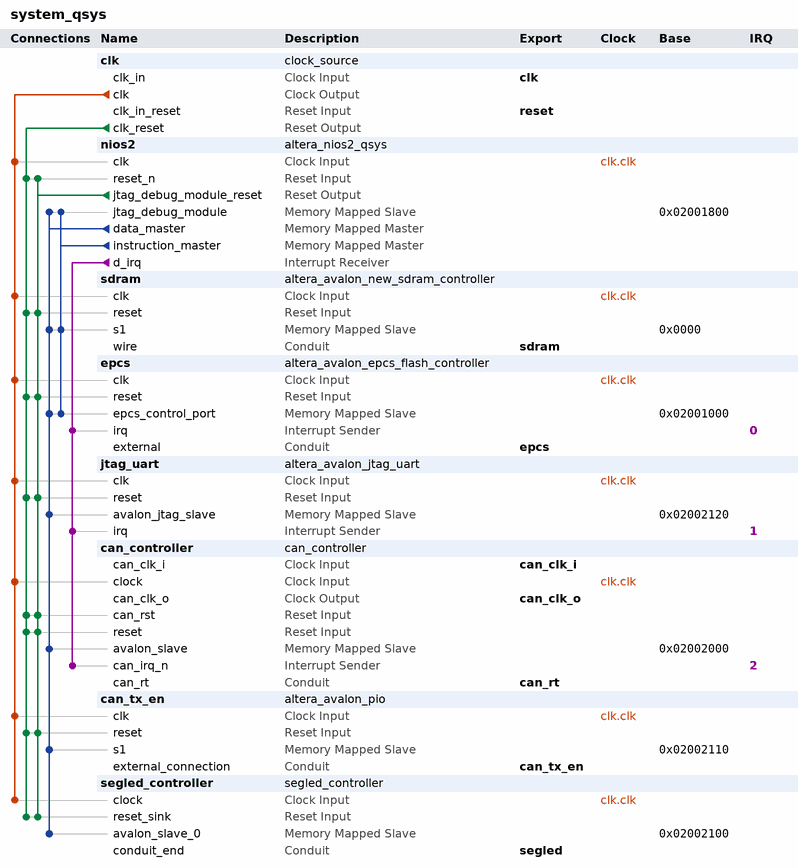
[diagram p0: system contents]
# Platform Designer (Qsys) system system_qsys, Cyclone IV E EP4CE10F17C8
# Parameters at their usual value, and those the tool derives, are not listed.
package require -exact qsys 13.1
create_system system_qsys
set_project_property DEVICE_FAMILY {Cyclone IV E}
set_project_property DEVICE EP4CE10F17C8

add_instance clk clock_source 13.1
set_instance_parameter_value clk clockFrequency 100000000
set_instance_parameter_value clk resetSynchronousEdges DEASSERT

add_instance nios2 altera_nios2_qsys 13.1
set_instance_parameter_value nios2 resetSlave epcs.epcs_control_port
set_instance_parameter_value nios2 mmu_TLBMissExcSlave None
set_instance_parameter_value nios2 exceptionSlave sdram.s1
set_instance_parameter_value nios2 breakSlave nios2.jtag_debug_module
set_instance_parameter_value nios2 impl Fast
set_instance_parameter_value nios2 icache_size 4096

add_instance sdram altera_avalon_new_sdram_controller 13.1
set_instance_parameter_value sdram TAC 5.4
set_instance_parameter_value sdram TRCD 20.0
set_instance_parameter_value sdram TRFC 64.0
set_instance_parameter_value sdram TRP 20.0
set_instance_parameter_value sdram TWR 20.0
set_instance_parameter_value sdram casLatency 3
set_instance_parameter_value sdram columnWidth 9
set_instance_parameter_value sdram dataWidth 16
set_instance_parameter_value sdram generateSimulationModel false
set_instance_parameter_value sdram initRefreshCommands 8
set_instance_parameter_value sdram model single_Micron_MT48LC4M32B2_7_chip
set_instance_parameter_value sdram numberOfBanks 4
set_instance_parameter_value sdram numberOfChipSelects 1
set_instance_parameter_value sdram powerUpDelay 200.0
set_instance_parameter_value sdram refreshPeriod 7.8125
set_instance_parameter_value sdram rowWidth 13

add_instance epcs altera_avalon_epcs_flash_controller 13.1
set_instance_parameter_value epcs autoSelectASMIAtom false

add_instance jtag_uart altera_avalon_jtag_uart 13.1
set_instance_parameter_value jtag_uart simInteractiveOptions NO_INTERACTIVE_WINDOWS

add_instance can_controller can_controller 1.0

add_instance can_tx_en altera_avalon_pio 13.1
set_instance_parameter_value can_tx_en direction Input
set_instance_parameter_value can_tx_en width 1

add_instance segled_controller segled_controller 1.0

# connections
add_connection clk.clk can_controller.clock clock
add_connection clk.clk can_tx_en.clk clock
add_connection clk.clk epcs.clk clock
add_connection clk.clk jtag_uart.clk clock
add_connection clk.clk nios2.clk clock
add_connection clk.clk sdram.clk clock
add_connection clk.clk segled_controller.clock clock
add_connection clk.clk_reset can_controller.can_rst reset
add_connection clk.clk_reset can_controller.reset reset
add_connection clk.clk_reset can_tx_en.reset reset
add_connection clk.clk_reset epcs.reset reset
add_connection clk.clk_reset jtag_uart.reset reset
add_connection clk.clk_reset nios2.reset_n reset
add_connection clk.clk_reset sdram.reset reset
add_connection clk.clk_reset segled_controller.reset_sink reset
add_connection nios2.jtag_debug_module_reset can_controller.can_rst reset
add_connection nios2.jtag_debug_module_reset can_controller.reset reset
add_connection nios2.jtag_debug_module_reset can_tx_en.reset reset
add_connection nios2.jtag_debug_module_reset epcs.reset reset
add_connection nios2.jtag_debug_module_reset jtag_uart.reset reset
add_connection nios2.jtag_debug_module_reset nios2.reset_n reset
add_connection nios2.jtag_debug_module_reset sdram.reset reset
add_connection nios2.jtag_debug_module_reset segled_controller.reset_sink reset
add_connection nios2.data_master can_controller.avalon_slave avalon
set_connection_parameter_value nios2.data_master/can_controller.avalon_slave baseAddress 0x02002000
add_connection nios2.data_master can_tx_en.s1 avalon
set_connection_parameter_value nios2.data_master/can_tx_en.s1 baseAddress 0x02002110
add_connection nios2.data_master epcs.epcs_control_port avalon
set_connection_parameter_value nios2.data_master/epcs.epcs_control_port baseAddress 0x02001000
add_connection nios2.data_master jtag_uart.avalon_jtag_slave avalon
set_connection_parameter_value nios2.data_master/jtag_uart.avalon_jtag_slave baseAddress 0x02002120
add_connection nios2.data_master nios2.jtag_debug_module avalon
set_connection_parameter_value nios2.data_master/nios2.jtag_debug_module baseAddress 0x02001800
add_connection nios2.data_master sdram.s1 avalon
set_connection_parameter_value nios2.data_master/sdram.s1 baseAddress 0x0000
add_connection nios2.data_master segled_controller.avalon_slave_0 avalon
set_connection_parameter_value nios2.data_master/segled_controller.avalon_slave_0 baseAddress 0x02002100
add_connection nios2.instruction_master epcs.epcs_control_port avalon
set_connection_parameter_value nios2.instruction_master/epcs.epcs_control_port baseAddress 0x02001000
add_connection nios2.instruction_master nios2.jtag_debug_module avalon
set_connection_parameter_value nios2.instruction_master/nios2.jtag_debug_module baseAddress 0x02001800
add_connection nios2.instruction_master sdram.s1 avalon
set_connection_parameter_value nios2.instruction_master/sdram.s1 baseAddress 0x0000
add_connection nios2.d_irq can_controller.can_irq_n interrupt
set_connection_parameter_value nios2.d_irq/can_controller.can_irq_n irqNumber 2
add_connection nios2.d_irq epcs.irq interrupt
set_connection_parameter_value nios2.d_irq/epcs.irq irqNumber 0
add_connection nios2.d_irq jtag_uart.irq interrupt
set_connection_parameter_value nios2.d_irq/jtag_uart.irq irqNumber 1

# exported interfaces
add_interface clk clock sink
set_interface_property clk EXPORT_OF clk.clk_in
add_interface reset reset sink
set_interface_property reset EXPORT_OF clk.clk_in_reset
add_interface epcs conduit end
set_interface_property epcs EXPORT_OF epcs.external
add_interface sdram conduit end
set_interface_property sdram EXPORT_OF sdram.wire
add_interface can_tx_en conduit end
set_interface_property can_tx_en EXPORT_OF can_tx_en.external_connection
add_interface can_clk_i clock sink
set_interface_property can_clk_i EXPORT_OF can_controller.can_clk_i
add_interface can_rt conduit end
set_interface_property can_rt EXPORT_OF can_controller.can_rt
add_interface can_clk_o clock source
set_interface_property can_clk_o EXPORT_OF can_controller.can_clk_o
add_interface segled conduit end
set_interface_property segled EXPORT_OF segled_controller.conduit_end

set_interconnect_requirement {$system} qsys_mm.clockCrossingAdapter HANDSHAKE
set_interconnect_requirement {$system} qsys_mm.maxAdditionalLatency 1
set_interconnect_requirement {$system} qsys_mm.insertDefaultSlave false

save_system system_qsys.qsys
